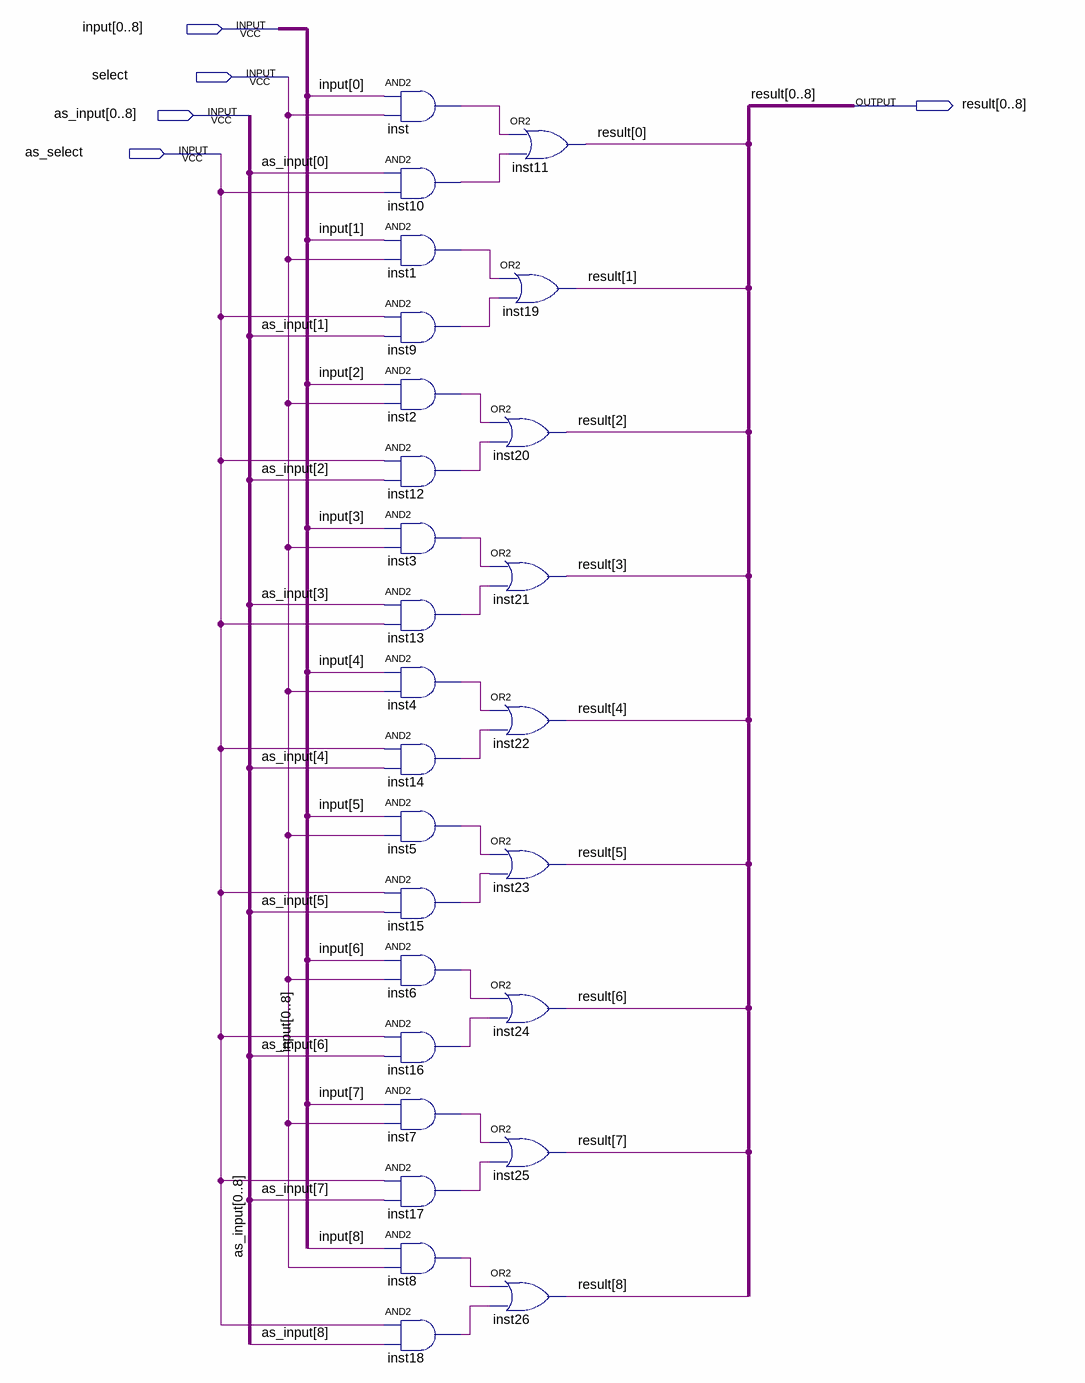
[diagram p0: schematic sheet]
// Quartus schematic input_select.bdf as structural Verilog: 27 symbols, 5 pins
module input_select (
  input  [0:8] \input ,
  input  select,
  input  [0:8] as_input,
  input  as_select,
  output [0:8] result
);

  wire inst1_out, inst2_out, inst3_out, inst4_out, inst5_out, inst6_out, inst7_out, inst8_out, inst9_out,
       inst10_out, inst12_out, inst13_out, inst14_out, inst15_out, inst16_out, inst17_out, inst18_out,
       inst_out;

  and inst (inst_out, \input [0], select);
  and inst10 (inst10_out, as_input[0], as_select);
  and inst1 (inst1_out, \input [1], select);
  and inst9 (inst9_out, as_select, as_input[1]);
  and inst2 (inst2_out, \input [2], select);
  and inst12 (inst12_out, as_select, as_input[2]);
  and inst3 (inst3_out, \input [3], select);
  and inst13 (inst13_out, as_input[3], as_select);
  and inst4 (inst4_out, \input [4], select);
  and inst14 (inst14_out, as_select, as_input[4]);
  and inst5 (inst5_out, \input [5], select);
  and inst15 (inst15_out, as_select, as_input[5]);
  and inst6 (inst6_out, \input [6], select);
  and inst16 (inst16_out, as_select, as_input[6]);
  and inst7 (inst7_out, \input [7], select);
  and inst17 (inst17_out, as_select, as_input[7]);
  and inst8 (inst8_out, \input [8], select);
  and inst18 (inst18_out, as_select, as_input[8]);
  or inst20 (result[2], inst2_out, inst12_out);
  or inst21 (result[3], inst3_out, inst13_out);
  or inst22 (result[4], inst4_out, inst14_out);
  or inst23 (result[5], inst5_out, inst15_out);
  or inst24 (result[6], inst6_out, inst16_out);
  or inst25 (result[7], inst7_out, inst17_out);
  or inst26 (result[8], inst8_out, inst18_out);
  or inst11 (result[0], inst_out, inst10_out);
  or inst19 (result[1], inst1_out, inst9_out);
endmodule
